# EasyEDA Pro project sonnette.epro, board PCB1
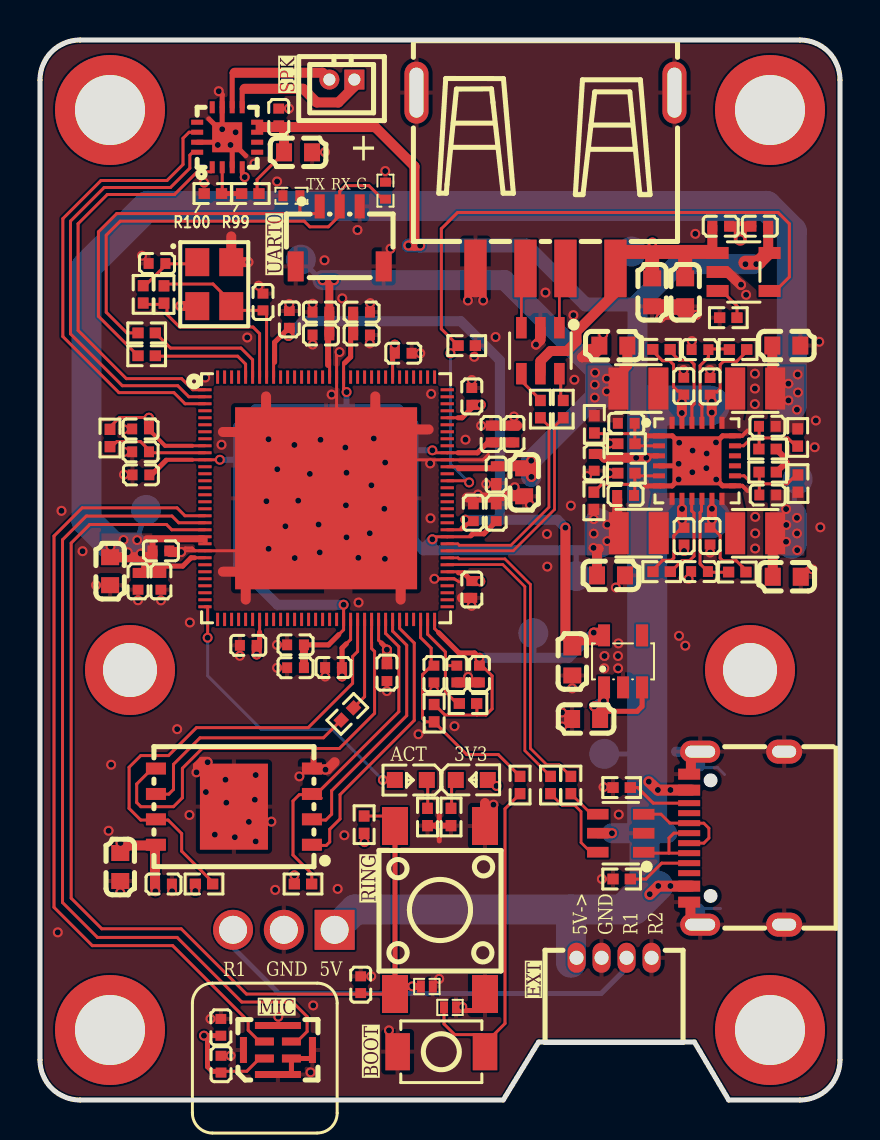
[diagram p1: board, top side]
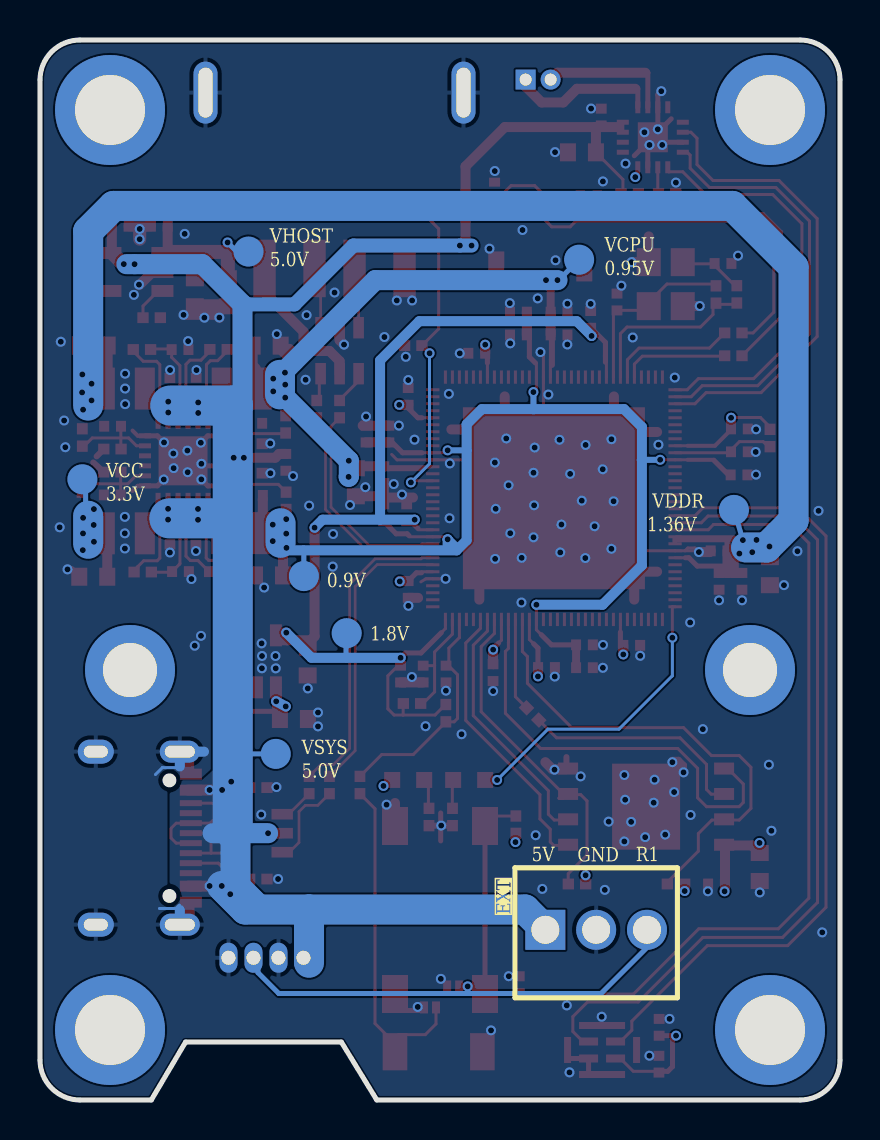
[diagram p2: board, bottom side, seen from below]

Outline 40 x 53 mm; copper layers: Top Layer, Inner1, Inner2, Bottom Layer. Coordinates in mm from the lower left corner of the outline.
Outline path: 0,51 0,2 arc(0.59,0.59) 2,0 23.16,0 24.93,2.9 32.72,2.9 34.44,0 38,0 arc(39.41,0.59) 40,2 40,51 arc(39.41,52.41) 38,53 2,53 arc(0.59,52.41) 0,51
Stack: Top Layer 0.035mm Outer layer thickness 1oz / Dielectric1 0.0994mm 3313 RC57% 4.2mil / Inner1 0.0152mm Inner layer thickness / Dielectric2 1.265mm 1.3mm H/HOZ Copper / Inner2 0.0152mm Inner layer thickness / Dielectric3 0.0994mm 3313 RC57% 4.2mil / Bottom Layer 0.035mm Outer layer thickness 1oz

## Design rules (mm)
template: Custom Config
spacing copperThickness1oz (default): track to track 0.14, other pairs 0.05 to 0.3
spacing copperThickness2oz: track to track 0.203, other pairs 0.152 to 0.3
track width copperThickness1oz (default): min 0.09, default 0.15, max 2.54
track width copperThickness2oz: min 0.203, default 0.254, max 2.54
differential pair differentialPair (default): width min 0.127, default 0.254, max 2.54; gap min 0.152, default 0.152
via viaSize (default): diameter min 0.35, default 0.5, max 10; hole min 0.2, default 0.3, max 6.3
pour e2646 uses copperRegion
pour e2644 uses copperRegion
pour e2643 uses copperRegion

## Placement (name value [footprint] x y rotation side)
C1  100nF  [C0402]  14.05 39.39 0 top
C2  100nF  [C0402]  22.81 31.27 90 top
C3  10uF  [C0402]  14.05 38.25 0 top
C4  22uF  [C0603]  24.21 30.89 90 top
C5  1uF  [C0402]  22.56 33.3 270 top
C6  100nF  [C0402]  16.08 38.25 180 top
C7  10uF  [C0402]  23.7 33.3 270 top
C8  100nF  [C0402]  12.78 22.76 0 top
C9  1uF  [C0402]  16.08 39.39 180 top
C10  1uF  [C0402]  12.78 21.61 0 top
C11  100nF  [C0402]  6.05 27.46 180 top
C12  100nF  [C0402]  6.05 25.93 90 top
C13  10uF  [C0402]  4.9 25.93 90 top
C14  22uF  [C0603]  3.51 26.44 90 top
C15  18pF  [C0402]  5.85 41.83 0 top
C16  18pF  [C0402]  11.15 39.9 90 top
C17  100nF  [C0402]  12.47 39.03 270 top
C18  10nF  [C0402]  5.03 32.41 180 top
C19  100nF  [C0402]  5.03 33.55 0 top
C20  100nF  [C0402]  5.05 31.26 0 top
C21  100nF  [C0402]  17.35 21.37 90 top
C22  1nF  [C0402]  19.7 21.3 270 top
C23  1nF  [C0402]  20.84 21.3 270 top
C24  100nF  [C0402]  21.59 25.53 90 top
C25  100nF  [C0402]  21.67 29.36 270 top
C26  100nF  [C0402]  21.97 21.3 90 top
C27  100nF  [C0402]  22.81 29.36 270 top
C28  100nF  [C0402]  21.59 35.18 270 top
C29  100nF  [C0402]  18.16 37.34 180 top
C30  100nF  [C0402]  14.68 21.62 0 top
C31  100nF  [C0402]  10.41 22.73 0 top
C47  4.7uF  [C0603]  27.31 19.05 0 top
C48  4.7uF  [C0603]  26.62 21.93 90 top
C52  100nF  [C0402]  6.18 10.8 180 top
C53  10uF  [C0603]  4.01 11.65 90 top
C61  1uF  [C0402]  35.99 43.69 0 top
C62  22uF  [C0603]  30.61 40.39 90 top
C63  22uF  [C0603]  32.26 40.39 90 top
C64  100nF  [C0402]  34.04 43.69 180 top
C71  220pF  [C0402]  36.39 30.25 180 top
C72  220pF  [C0402]  29.28 30.23 180 top
C73  220pF  [C0402]  29.31 33.83 180 top
C74  220pF  [C0402]  36.37 33.69 180 top
C81  1uF  [C0402]  27.71 31.88 90 top
C82  10uF  [C0402]  33.51 35.68 270 top
C83  10uF  [C0402]  32.19 35.69 270 top
C84  10uF  [C0402]  33.5 28.2 90 top
C85  10uF  [C0402]  32.2 28.19 90 top
C86  100nF  [C0402]  33 37.52 180 top
C87  100nF  [C0402]  32.98 26.42 180 top
C88  22uF  [C0603]  37.34 26.16 180 top
C89  22uF  [C0603]  28.55 26.23 180 top
C90  22uF  [C0603]  28.67 37.72 0 top
C91  22uF  [C0603]  37.32 37.72 180 top
C92  10uF  [C0603]  12.9 47.38 180 top
C93  100nF  [C0402]  11.94 49.15 270 top
C94  100nF  [C0402]  9.05 1.79 270 top
C95  1uF  [C0402]  9.04 3.63 270 top
C96  10nF  [C0402]  16.04 5.77 270 top
CN1  HC-1.25-2A  [CONN-TH_2P-P1.25_HCTL_HC-1.25-2A]  15.09 51.02 180 top
D7  ESD5451N-MS  [DFN1006-2L_L1.0-W0.6-P0.60-BI]  20.5 4.63 0 top
D8  USBLC6-2SC6  [SOT-23-6_L2.9-W1.6-P0.95-LS2.8-BL]  29.04 13.34 90 top
D10  USBLC6-2SC6  [SOT-23-6_L2.9-W1.6-P0.95-LS2.8-BL]  25.02 37.47 180 top
D11  ESD5451N-MS  [DFN1006-2L_L1.0-W0.6-P0.60-BI]  19.34 5.67 0 top
LED4  KT-0603R  [LED0603-RD]  21.59 16 0 top
LED5  KT-0603R  [LED0603-RD]  18.54 16 180 top
MIC1  MP34DT05TR-A  [MIC-SMD_5P-L3.0-W4.0-P0.85-BL]  11.9 2.5 0 top
NOREF  -  [Pad_e89]  36.5 49.5 0 top
NOREF#2  -  [Pad_e82]  3.5 3.5 0 top
NOREF#3  -  [Pad_e104]  3.5 49.5 0 top
NOREF#4  -  [Pad_e67124]  4.5 21.5 0 top
NOREF#5  -  [Pad_e84]  36.5 3.5 0 top
NOREF#6  -  [Pad_e67123]  35.5 21.5 0 top
R6  22Ω  [R0402]  5.16 40.28 90 top
R7  1MΩ  [R0402]  6.2 40.28 90 top
R16  1kΩ  [R0402]  20.55 14.15 270 top
R17  1kΩ  [R0402]  19.38 14.15 90 top
R33  1kΩ  [R0402]  3.5 33.1 90 top
R34  22Ω  [R0402]  15.37 19.3 45 top
R35  10kΩ  [R0402]  19.71 19.34 90 top
R36  10kΩ  [R0402]  21.4 19.83 0 top
R39  100Ω  [R0402]  24 15.75 270 top
R40  5.1kΩ  [R0402]  29.08 11.05 180 top
R41  5.1kΩ  [R0402]  29.08 15.62 180 top
R42  100Ω  [R0402]  5.33 38.35 180 top
R43  100Ω  [R0402]  5.33 37.21 180 top
R77  10kΩ  [R0402]  13.15 10.8 180 top
R78  10kΩ  [R0402]  8.2 10.8 180 top
R81  2.2Ω  [R0402]  25.53 15.75 90 top
R82  2.2Ω  [R0402]  26.54 15.75 90 top
R83  2.2Ω  [R0402]  26.16 34.54 270 top
R84  2.2Ω  [R0402]  25.02 34.54 270 top
R85  100kΩ  [R0402]  21.34 37.72 180 top
R86  6.8kΩ  [R0402]  34.42 39.12 0 top
R87  510kΩ  [R0402]  37.9 30.82 270 top
R88  110kΩ  [R0402]  36.38 31.4 180 top
R89  150kΩ  [R0402]  37.88 33.13 90 top
R90  120kΩ  [R0402]  36.38 32.55 180 top
R91  120kΩ  [R0402]  29.32 32.81 0 top
R92  100kΩ  [R0402]  29.32 31.34 0 top
R93  69.8kΩ  [R0402]  27.72 33.78 90 top
R94  49.9kΩ  [R0402]  27.69 29.96 270 top
R95  10kΩ  [R0402]  31.08 26.42 180 top
R96  10kΩ  [R0402]  31.07 37.53 180 top
R97  100kΩ  [R0402]  34.9 37.53 0 top
R98  150kΩ  [R0402]  34.86 26.4 180 top
R99  0Ω  [R0402]  10.51 45.32 180 top
R100  0Ω  [R0402]  8.64 45.32 0 top
R101  10kΩ  [R0402]  16.21 13.77 270 top
SW5  TS-1002S-05026C  [KEY-SMD_4P-L6.0-W6.0-P4.50-LS9.0]  20 9.5 90 top
SW6  TS-1088-AR02016  [SW-SMD_L3.9-W3.0-P4.45]  20.07 2.41 180 top
TP2  -  [Test-Point-0.5mm]  29.58 42.42 180 bottom
TP4  -  [Test-Point-0.5mm]  26.81 26.2 180 bottom
TP5  -  [Test-Point-0.5mm]  5.3 29.5 180 bottom
TP6  -  [Test-Point-0.5mm]  13.04 42.02 180 bottom
TP7  -  [Test-Point-0.5mm]  37.88 31.04 180 bottom
TP8  -  [Test-Point-0.5mm]  24.67 23.34 180 bottom
TP9  -  [Test-Point-0.5mm]  28.21 17.31 180 bottom
U1  RK3506G2  [QFN-128_L12.3-W12.3-P0.35-TL-EP9.1]  14.3 30.09 0 top
U4  ESD5341N  [DFN1006-2L-BI]  12.57 45.21 0 top
U5  ESD5341N  [DFN1006-2L-BI]  17.27 45.47 270 top
U14  RT9013-18GB  [SOT-23-5_L3.0-W1.7-P0.95-LS2.8-BR]  29.15 21.93 270 top
U25  SGM2576YN5G/TR  [SOT-23-5_L2.9-W1.6-P0.95-LS2.8-TL]  35.18 41.4 0 top
U28  EA3059QDR  [VQFN-24_L4.0-W4.0-P0.50-TL-EP2.5]  32.85 31.96 0 top
U29  1.5uH  [IND-SMD_L2.5-W2.0_MEKK2520TR47M]  35.76 28.33 180 top
U30  1.5uH  [IND-SMD_L2.5-W2.0_MEKK2520TR47M]  29.94 28.34 0 top
U31  1.5uH  [IND-SMD_L2.5-W2.0_MEKK2520TR47M]  29.92 35.57 0 top
U32  1.5uH  [IND-SMD_L2.5-W2.0_MEKK2520TR47M]  35.76 35.57 180 top
U34  MAX98357AETE+T  [TQFN-16_L3.0-W3.0-P0.50-BL-EP1.5]  9.36 48.14 0 top
U35  ZX-MX1.25-4PWZ  [CONN-TH_4P-P1.25_ZX-MX1.25-4PWZ]  28.7 7.11 0 top
U36  ZX-SH1.0-3PLT  [CONN-SMD_3P-P1.00_HDGC_HDGC1002WV-S-3P]  14.99 43.18 0 top
U37  XT26G04CWSIGA  [WSON-8_L8.0-W6.0-P1.27-TL-EP-1]  9.7 14.67 180 top
U38  DB125-2.54-3P-GN-S  [CONN-TH_DB125-2.54-3P-GN]  12.19 8.51 180 bottom
USB2  TYPE-C 16PIN 2MD(073)  [USB-C-SMD_TYPE-C-6PIN-2MD-073]  34.83 13.09 90 top
USB4  10.0 QHHTZB6.3  [USB-A-TH_10.0QHHTZB6.3]  25.27 45.97 180 top
X3  24MHz  [CRYSTAL-SMD_4P-L3.2-W2.5-BL_SIT8008BI]  8.71 40.79 270 top

## Footprints (pads in the part's own frame, mm; a bottom-side part is the same pattern mirrored in y, then rotated)
C0402
  rect 0.5x0.54 smd: 1(-0.42,0) 2(0.42,0)
C0603
  rect 0.8x0.9 smd: 1(-0.7,0) 2(0.7,0)
CONN-SMD_3P-P1.00_HDGC_HDGC1002WV-S-3P
  rect 0.5x1.2 smd: 1(-1,1.5) 2(0,1.5) 3(1,1.5)
  rect 0.8x1.5 smd: 4(2.2,-1.5) 5(-2.2,-1.5)
CONN-TH_2P-P1.25_HCTL_HC-1.25-2A
  rect 1x1 hole 0.6: 1(-0.625,0)
  round 1 hole 0.6: 2(0.625,0)
CONN-TH_4P-P1.25_ZX-MX1.25-4PWZ
  oval 0.9x1.5 hole 0.7: 1(-1.875,0) 2(-0.625,0) 3(0.625,0) 4(1.875,0)
CONN-TH_DB125-2.54-3P-GN
  rect 2x2 hole 1.4: 1(-2.54,0)
  round 2 hole 1.4: 2(0,0) 3(2.54,0)
CRYSTAL-SMD_4P-L3.2-W2.5-BL_SIT8008BI
  rect 1.4x1.2 smd: 1(-1.1,-0.85) 2(1.1,-0.85) 3(1.1,0.85) 4(-1.1,0.85)
DFN1006-2L-BI
  rect 0.45x0.55 smd: 1(-0.425,0) 2(0.425,0)
DFN1006-2L_L1.0-W0.6-P0.60-BI
  rect 0.4x0.6 smd: 1(-0.3,0) 2(0.3,0)
IND-SMD_L2.5-W2.0_MEKK2520TR47M
  rect 1x2.1 smd: 1(1,0) 2(-1,0)
KEY-SMD_4P-L6.0-W6.0-P4.50-LS9.0
  rect 1.9x1.3 smd: 1(-4.2,2.25) 2(4.2,2.25) 3(-4.2,-2.25) 4(4.2,-2.25)
LED0603-RD
  rect 0.8x0.8 smd: 1(-0.799,0) 2(0.799,0)
MIC-SMD_5P-L3.0-W4.0-P0.85-BL
  rect 0.95x0.4 smd: 1(-0.675,-0.425) 2(0.675,-0.425) 3(0.675,0.425) 4(-0.675,0.425)
  rect 0.35x1.3 smd: 5(-1.725,0) 5(1.725,0)
  rect 2.3x0.35 smd: 5(0,1.225) 5(0,-1.225)
Pad_e82
  round 5.5 hole 3.5: 1(0,0)
Pad_e84
  round 5.5 hole 3.5: 1(0,0)
Pad_e89
  round 5.5 hole 3.5: 1(0,0)
Pad_e104
  round 5.5 hole 3.5: 1(0,0)
Pad_e67123
  round 4.5 hole 2.7: 1(0,0)
Pad_e67124
  round 4.5 hole 2.7: 1(0,0)
QFN-128_L12.3-W12.3-P0.35-TL-EP9.1
  rect 0.665x0.15 smd: 1(-6.058,5.425) 2(-6.058,5.075) 3(-6.058,4.725) 4(-6.058,4.375) 5(-6.058,4.025) 6(-6.058,3.675) 7(-6.058,3.325) 8(-6.058,2.975) 9(-6.058,2.625) 10(-6.058,2.275) 11(-6.058,1.925) 12(-6.058,1.575) 13(-6.058,1.225) 14(-6.058,0.875) 15(-6.058,0.525) 16(-6.058,0.175) 17(-6.058,-0.175) 18(-6.058,-0.525) 19(-6.058,-0.875) 20(-6.058,-1.225) 21(-6.058,-1.575) 22(-6.058,-1.925) 23(-6.058,-2.275) 24(-6.058,-2.625) 25(-6.058,-2.975) 26(-6.058,-3.325) 27(-6.058,-3.675) 28(-6.058,-4.025) 29(-6.058,-4.375) 30(-6.058,-4.725) 31(-6.058,-5.075) 32(-6.058,-5.425) 65(6.058,-5.425) 66(6.058,-5.075) 67(6.058,-4.725) 68(6.058,-4.375) 69(6.058,-4.025) 70(6.058,-3.675) 71(6.058,-3.325) 72(6.058,-2.975) 73(6.058,-2.625) 74(6.058,-2.275) 75(6.058,-1.925) 76(6.058,-1.575) 77(6.058,-1.225) 78(6.058,-0.875) 79(6.058,-0.525) 80(6.058,-0.175) 81(6.058,0.175) 82(6.058,0.525) 83(6.058,0.875) 84(6.058,1.225) 85(6.058,1.575) 86(6.058,1.925) 87(6.058,2.275) 88(6.058,2.625) 89(6.058,2.975) 90(6.058,3.325) 91(6.058,3.675) 92(6.058,4.025) 93(6.058,4.375) 94(6.058,4.725) 95(6.058,5.075) 96(6.058,5.425)
  rect 0.15x0.665 smd: 33(-5.425,-6.058) 34(-5.075,-6.058) 35(-4.725,-6.058) 36(-4.375,-6.058) 37(-4.025,-6.058) 38(-3.675,-6.058) 39(-3.325,-6.058) 40(-2.975,-6.058) 41(-2.625,-6.058) 42(-2.275,-6.058) 43(-1.925,-6.058) 44(-1.575,-6.058) 45(-1.225,-6.058) 46(-0.875,-6.058) 47(-0.525,-6.058) 48(-0.175,-6.058) 49(0.175,-6.058) 50(0.525,-6.058) 51(0.875,-6.058) 52(1.225,-6.058) 53(1.575,-6.058) 54(1.925,-6.058) 55(2.275,-6.058) 56(2.625,-6.058) 57(2.975,-6.058) 58(3.325,-6.058) 59(3.675,-6.058) 60(4.025,-6.058) 61(4.375,-6.058) 62(4.725,-6.058) 63(5.075,-6.058) 64(5.425,-6.058) 97(5.425,6.058) 98(5.075,6.058) 99(4.725,6.058) 100(4.375,6.058) 101(4.025,6.058) 102(3.675,6.058) 103(3.325,6.058) 104(2.975,6.058) 105(2.625,6.058) 106(2.275,6.058) 107(1.925,6.058) 108(1.575,6.058) 109(1.225,6.058) 110(0.875,6.058) 111(0.525,6.058) 112(0.175,6.058) 113(-0.175,6.058) 114(-0.525,6.058) 115(-0.875,6.058) 116(-1.225,6.058) 117(-1.575,6.058) 118(-1.925,6.058) 119(-2.275,6.058) 120(-2.625,6.058) 121(-2.975,6.058) 122(-3.325,6.058) 123(-3.675,6.058) 124(-4.025,6.058) 125(-4.375,6.058) 126(-4.725,6.058) 127(-5.075,6.058) 128(-5.425,6.058)
  rect 9.1x9.1 smd: 129(0,0)
R0402
  rect 0.566x0.54 smd: 1(-0.433,0) 2(0.433,0)
SOT-23-5_L2.9-W1.6-P0.95-LS2.8-TL
  rect 1.1x0.6 smd: 1(-1.3,0.95) 2(-1.3,0) 3(-1.3,-0.95) 4(1.3,-0.95) 5(1.3,0.95)
SOT-23-5_L3.0-W1.7-P0.95-LS2.8-BR
  rect 1.1x0.6 smd: 1(1.3,-0.95) 2(1.3,0) 3(1.3,0.95) 4(-1.3,0.95) 5(-1.3,-0.95)
SOT-23-6_L2.9-W1.6-P0.95-LS2.8-BL
  rect 0.532x1.072 smd: 1(-0.95,-1.149) 2(0,-1.149) 3(0.95,-1.149) 4(0.95,1.149) 5(0,1.149) 6(-0.95,1.149)
SW-SMD_L3.9-W3.0-P4.45
  rect 1.23x1.86 smd: 1(-2.185,0) 2(2.185,0)
Test-Point-0.5mm
  round 1.5 smd: 1(0,0)
TQFN-16_L3.0-W3.0-P0.50-BL-EP1.5
  rect 0.25x0.6 smd: 1(-0.749,-1.5) 2(-0.248,-1.5) 3(0.252,-1.5) 4(0.751,-1.5) 9(0.75,1.5) 10(0.25,1.5) 11(-0.25,1.5) 12(-0.749,1.5)
  rect 0.6x0.25 smd: 5(1.5,-0.748) 6(1.5,-0.248) 7(1.5,0.252) 8(1.5,0.752) 13(-1.5,0.752) 14(-1.5,0.252) 15(-1.5,-0.248) 16(-1.5,-0.748)
  rect 1.5x1.5 smd: 17(0,0)
USB-A-TH_10.0QHHTZB6.3
  rect 1.12x2.88 smd: 1(-3.5,4.395) 2(-1,4.395) 3(1,4.395) 4(3.5,4.395)
  oval 1.2x3.1 hole 0.7x2.5: 5(-6.45,-4.395) 6(6.45,-4.395)
USB-C-SMD_TYPE-C-6PIN-2MD-073
  rect 0.55x1.1 smd: 1(-3.2,2.375) 2(-2.4,2.375) 11(2.4,2.375) 12(3.2,2.375)
  rect 0.3x1.1 smd: 3(-1.75,2.375) 4(-1.25,2.375) 5(-0.75,2.375) 6(-0.25,2.375) 7(0.25,2.375) 8(0.75,2.375) 9(1.25,2.375) 10(1.75,2.375)
  oval 1.1x2 hole 0.6x1.5: 13(-4.325,1.825) 14(4.325,1.825)
  oval 1.2x1.8 hole 0.6x1.2: 13(-4.325,-2.375) 14(4.325,-2.375)
VQFN-24_L4.0-W4.0-P0.50-TL-EP2.5
  rect 0.6x0.25 smd: 1(-1.9,1.25) 2(-1.9,0.75) 3(-1.9,0.25) 4(-1.9,-0.25) 5(-1.9,-0.75) 6(-1.9,-1.25) 13(1.9,-1.25) 14(1.9,-0.75) 15(1.9,-0.25) 16(1.9,0.25) 17(1.9,0.75) 18(1.9,1.25)
  rect 0.25x0.6 smd: 7(-1.25,-1.9) 8(-0.75,-1.9) 9(-0.25,-1.9) 10(0.249,-1.9) 11(0.75,-1.9) 12(1.25,-1.9) 19(1.25,1.9) 20(0.75,1.9) 21(0.249,1.9) 22(-0.25,1.9) 23(-0.75,1.9) 24(-1.25,1.9)
  rect 2.45x2.45 smd: 25(0,0)
WSON-8_L8.0-W6.0-P1.27-TL-EP-1
  rect 1x0.6 smd: 1(-3.9,1.905) 2(-3.9,0.635) 3(-3.9,-0.635) 4(-3.9,-1.905) 5(3.9,-1.905) 6(3.9,-0.635) 7(3.9,0.635) 8(3.9,1.905)
  rect 3.4x4.3 smd: 9(0,0)

## Nets
As in the schematic.

Pads without a net: NOREF 1; NOREF#2 1; NOREF#3 1; NOREF#4 1; NOREF#5 1; NOREF#6 1; U1 26 27 28 29 30 31 60 61 65 66 67 68 77 78 79 80 81 82 84 88 89 90 91 93 94 95 96 97 98 99 100 101 102 104 105 106 107 108 109 113 114 115 116 117 118 119 125; U14 4; U28 15 16; U34 5 6 12 13; USB2 3 9

## Via types
v1: diameter 0.5, hole 0.3, Top Layer to Bottom Layer, 268 vias

## Routing (per net, layer and track width the routed paths; a pad name or vN(x,y) marks a point on that pad's centre or on a via; arc(x,y) is an arc through that point)
GND: length 121.2
  Top Layer w0.15: 7.12,27.46 7.26,27.6 7.61,27.6 7.75,27.46 ; 7.12,27.46 7.75,27.46 ; 7.12,27.46 v1(7.05,27.4) ; 7.75,27.46 U1.24 11.14,27.46 ; U1.69 20.71,26.06 20.96,25.91 ; 22.42,32.28 22.15,32.01 16.23,32.01 ; v1(19.72,26.06) 20.36,26.06 ; 14.83,30.61 U1.111 14.83,37.25 v1(14.98,37.4) ; 12.57,1.28 MIC1.5
  Top Layer w0.2: 34.74,30.71 35.12,30.71 35.38,30.45 ; 34.74,33.21 35.11,33.21 35.38,33.47
  Top Layer w0.25: U34.15 9.11,47.89 U34.17 9.11,48.39 U34.11 9.11,50.25 9.09,50.27 9.09,50.28 v1(8.94,50.44) ; v1(31.93,31.03) 31.61,30.7 31.01,30.7 ; U34.3 9.61,47.67 v1(9.53,47.75) ; 8.69,48.81 8.44,49.06 ; D7.2 20.8,4.48 20.8,4.47 21.65,4.47 22.25,5.07 SW5.3 ; 30.27,30.7 31.01,30.7 ; 31.01,30.7 31.01,30.71 ; 30.97,31.71 31.83,31.71 v1(31.93,31.81) ; 10.28,47.21 10.04,47.46 ; 19.96,12.95 19.96,14.35 ; v1(31.96,32.86) 31.62,33.21 U28.1 30.34,33.21 ; 34.73,33.21 34.13,33.21 v1(33.8,32.88) ; 12.57,1.28 MIC1.2 13.62,2.08 MIC1.5 ; v1(33.81,31.03) 34.13,30.71 34.74,30.71
  Top Layer w0.3: 20.65,13.72 19.51,13.72 ; 8.4,17.01 8.07,17.01 7.8,16.74 7.8,16.37 ; R90.1 36.81,32.54 37.17,32.18 ; v1(38.62,26.53) 38.41,26.53 C88.1 ; 7.8,16.35 7.8,16.37 ; 7.8,16.37 8.22,16.79 8.22,16.88 ; 13.68,16.54 13.68,17.14 ; R88.1 arc(37.07,31.64) 37.34,31.88
  Top Layer w0.5: U1.129 18.03,26.36 18.03,25.02 ; U1.129 16.76,32.55 ; U1.129 10.63,26.42 ; U1.129 11.3,33.09 ; X3.2 7.86,39.7 v1(7.01,39.7) ; v1(32.82,39.26) 31.18,39.26 31.04,39.12 v1(31.03,39.12) ; 14.73,16.89 14.38,16.54 13.68,16.54 ; C26.1 C23.2 ; D10.2 25.02,37.99 v1(24.8,37.77) ; 35.04,40.74 34.32,41.45 ; 22.81,30.19 C2.1 ; 22.81,30.19 22.74,30.12 21.35,30.12 ; 22.81,30.19 C27.1 ; 22.81,30.19 22.81,30.19 C4.1 ; USB2.1 32.52,9.83 32.52,8.69 32.5,8.67 ; 9.14,26.42 10.63,26.42 ; 10.63,26.42 10.29,26.07 10.29,25.02 ; 16.76,32.55 17.75,33.53 19.43,33.53 ; 16.76,32.55 16.76,35.18 ; C5.1 23.86,33.72 ; C61.1 C64.1 ; 9.14,33.4 10.99,33.4 11.3,33.09 ; C11.1 6.53,27.4 v1(7.05,27.4) ; v1(10.42,41.89) X3.4 9.56,43.18 ; 32.29,17.29 32.27,17.31 ; 27.53,37.56 27.1,37.14 27.57,37.14 27.97,37.53 C90.1 ; 11.3,35.18 11.3,33.09 ; SW5.4 22.25,14.85 ; 32.54,16.31 32.54,17.29 ; C24.1 21.1,25.11
  Top Layer w0.65: v1(35.01,43.55) v1(35.01,43.04)
  Top Layer w0.7: C62.1 C63.1
  Inner2 w0.5: v1(35.74,34.79) 35.75,34.8 v1(35.75,35.57) v1(35.75,36.32) ; v1(32.26,22.71) v1(31.95,23.21) ; 28.28,21.58 v1(28.21,21.58) 28.22,21.59 v1(28.22,22.2) v1(28.9,22.2) 28.28,21.58 ; 28.28,21.58 28.9,21.58 v1(28.91,21.59) 28.92,21.6 v1(28.92,22.83) ; v1(35.01,43.55) v1(35.01,43.04) ; v1(21.4,39.98) v1(22.16,39.98) ; v1(24.5,29.75) v1(23.73,30.64) ; v1(35.76,27.57) 35.76,27.58 v1(35.76,28.33) v1(35.76,29.16) ; v1(31.03,39.12) 32.69,39.12 v1(32.82,39.26) ; v1(21.9,30.27) v1(22.31,30.8) ; v1(26.1,18.68) v1(26.1,19.38) ; v1(35.31,40.26) v1(35.05,40.77)
  Bottom Layer w0.15: 34.03,9.58 33.2,9.58 33.03,9.75 ; 33.01,16.67 33.06,16.62 33.88,16.62 34.22,16.28
  Bottom Layer w0.5: 33.01,16.67 USB2.14 31.8,17.42 ; USB2.13 33.01,9.5
  vias: v1(0.89,8.38) v1(1.07,29.46) v1(2.13,27.44) v1(2.8,25.74) v1(3.43,13.46) v1(3.56,16.76) v1(4.01,10.38) v1(4.2,33.53) v1(4.21,32.4) v1(4.2,31.27) v1(4.9,24.99) v1(5.1,42.22) v1(6.05,24.98) v1(6.61,10.44) v1(6.86,18.54) v1(7.49,23.88) v1(7.47,14.25) v1(7.82,16.38) v1(8.2,45.87) v1(8.26,36.12) v1(8.29,15.4) v1(8.38,16.89) v1(8.52,4.06) v1(8.74,13.27) v1(8.89,47.75) v1(9.11,48.54) v1(9.08,32.76) v1(9.27,16.01) v1(9.32,14.86) v1(9.53,2.21) v1(9.74,13.14) v1(9.78,48.39) v1(9.99,22.21) v1(10.36,38.12) v1(10.44,13.91) v1(10.72,46.82) v1(10.74,15.01) v1(10.78,16.25) v1(10.78,12.93) v1(10.93,40.71) v1(11.32,29.94) v1(11.43,33.04) v1(11.43,27.56) v1(11.57,13.92) v1(11.85,22.75) v1(11.76,10.51) v1(11.85,45.93) v1(11.86,31.54) v1(11.86,21.61) v1(11.92,4.16) v1(12.27,28.69) v1(12.45,49.57) v1(12.47,39.81) v1(12.72,32.75) v1(12.74,27.1) v1(12.91,29.97) v1(12.97,16.18) v1(13.49,31.31) v1(13.53,1.38) v1(13.63,39.81) v1(13.63,37.78) v1(13.66,4.73) v1(13.93,28.77) v1(14.03,33.01) v1(13.99,27.38) v1(14.25,47.39) v1(14.22,41.99) v1(14.26,21.17) v1(14.28,16.52) v1(14.58,35.27) v1(14.88,10.56) v1(15.11,40.08) v1(15.22,13.24) v1(15.27,32.62) v1(15.32,31.36) v1(15.3,29.73) v1(15.32,28.13) v1(15.88,43.5) v1(15.92,27.11) v1(15.93,24.88) v1(16.51,39.84) v1(16.49,37.83) v1(16.49,28.34) v1(16.57,30.74) v1(16.56,6.19) v1(16.69,33.08) v1(17.22,29.56) v1(17.24,27.06) v1(17.26,46.45) v1(17.26,31.87) v1(17.34,20.45) v1(17.45,3.48) v1(17.53,42.57) v1(18.92,18.29) v1(19.01,37.33) v1(19.51,31.83) v1(19.52,29.09) v1(19.56,35.31) v1(19.7,20.47) v1(19.94,13.72) v1(19.96,6.06) v1(20.72,18.69) v1(21.11,4.65) v1(21.27,33.02) v1(21.41,21.15) v1(21.59,36) v1(21.58,24.71) v1(21.71,37.16) v1(22.06,33.72) v1(22.67,14.77) v1(22.78,38.15) v1(23.7,34.17) v1(25.27,40.37) v1(25.35,28.3) v1(25.37,26.67) v1(26.54,29.72) v1(26.61,20.58) v1(26.67,39.24) v1(26.72,36.01) v1(27.35,31.2) v1(28.1,11.05) v1(28.16,38.29) v1(28.18,15.65) v1(28.49,32.83) v1(28.48,31.34) v1(28.79,25.62) v1(28.94,14.27) v1(31.78,39.12) v1(32.18,36.5) v1(32.2,27.45) v1(32.43,26.05) v1(32.59,37.94) v1(32.63,32.47) v1(32.62,31.39) v1(32.77,43.31) v1(33.34,32.32) v1(33.32,31.59) v1(33.5,36.5) v1(33.5,27.37) v1(38.74,32.64) v1(38.79,33.97) v1(38.96,37.91) v1(39.02,28.64)
VCC5V0_SYS: length 135.7
  Top Layer w0.15: 12.2,47.25 12.08,47.25 10.85,46.03 10.85,45.41 R99.1 ; 35.11,26.67 34.81,26.96 34.14,26.96 34.01,27.09 34.01,28.23 33.71,28.53 33.67,28.53 ; 35.11,26.67 35.12,26.66 ; 35.11,26.67 35.22,26.56 ; 33.5,35.26 33.64,35.4 33.85,35.4 34.01,35.56 34.01,36.77 34.18,36.94 34.84,36.94 35.22,37.32 35.22,37.53 ; 32.04,35.45 31.88,35.45 31.68,35.65 31.68,36.77 31.48,36.97 31.12,36.97 30.66,37.42 30.66,37.57 ; 32.01,28.54 31.69,28.22 31.69,27.1 31.57,26.98 31.13,26.98 30.67,26.53 30.67,26.41 ; U34.8 U34.7
  Top Layer w0.25: 30.9,32.21 30.43,32.21 30.33,32.12
  Top Layer w0.5: v1(28.6,13.34) D8.5 ; v1(32.09,34.35) 32.09,34.87 ; 12.23,48.65 11.07,48.65 ; 12.23,48.65 16.76,48.65 18.72,46.68 18.72,42.72 ; 12.23,48.65 12.2,48.62 C92.2 ; v1(33.59,34.38) v1(33.59,34.92) ; C81.2 28.05,32.3 28.24,32.11 29.81,32.11 ; U25.5 36.41,42.42 C61.2 ; 18.72,42.72 v1(18.42,42.72) ; 18.72,42.72 v1(19.01,42.72) ; 29.81,32.11 v1(29.81,32.11) ; 29.81,32.11 v1(30.31,32.11) ; v1(33.6,29.02) v1(33.6,29.56) ; v1(32.1,29.01) v1(32.1,29.55)
  Top Layer w0.55: 30.91,10.69 32.58,10.69 ; 30.44,15.91 30.89,15.5 ; 30.9,15.49 32.58,15.49 ; 30.49,10.28 30.91,10.69
  Top Layer w0.7: 35.92,41.92 35.96,41.92 36.42,42.37 ; 35.92,41.87 35.27,41.87
  Inner1 w0.5: v1(35.81,41.8) 35.81,41.79 v1(35.27,41.79) ; 30.9,15.5 v1(31.52,15.5) ; v1(30.89,15.5) v1(30.44,15.92) ; v1(18.42,42.72) v1(19.01,42.72) ; v1(32.09,34.88) v1(32.09,34.35) ; v1(30.49,10.29) v1(30.91,10.7) 31.52,10.7 v1(31.52,10.7) ; v1(33.6,29.56) v1(33.6,29.02) ; v1(29.81,32.11) v1(30.31,32.11) ; v1(32.1,29.55) v1(32.1,29.01) ; v1(33.59,34.92) v1(33.59,34.38)
  Inner2 w0.5: v1(30.31,32.11) 30.31,32.11 v1(29.81,32.11) ; v1(32.1,29.55) v1(32.1,29.01) ; v1(18.42,42.72) v1(19.01,42.72) ; 30.9,15.5 v1(31.52,15.5) ; v1(31.52,10.7) 31.52,10.7 v1(30.91,10.7) v1(30.49,10.29) ; v1(32.09,34.88) v1(32.09,34.35) ; v1(35.81,41.8) 35.81,41.79 v1(35.27,41.79) ; v1(33.59,34.92) v1(33.59,34.38) ; v1(30.44,15.92) v1(30.89,15.5) ; v1(33.6,29.56) v1(33.6,29.02)
  Bottom Layer w0.25: TP9.1 29.81,17.31 29.84,17.27
  Bottom Layer w0.7: v1(18.42,42.72) v1(19.01,42.72) 24.33,42.72 27.28,39.78 29.88,39.78
  Bottom Layer w1: 31.37,13.34 v1(28.6,13.34) ; 35.68,41.79 v1(35.27,41.79) 31.88,41.79 29.88,39.78 29.88,34.72
  Bottom Layer w1.5: 26.55,9.53 29.74,9.53 v1(30.91,10.7) ; 26.55,9.53 15.75,9.53 U38.1 ; 26.55,9.53 26.55,6.86 ; 30.23,10.16 30.23,13.34 ; 29.26,9.67 30.02,10.43
  Bottom Layer w2: 30.36,13.59 30.36,34.72 33.49,34.72 ; 30.61,29.08 33.53,29.08
VCC_1V8: length 55.5
  Top Layer w0.15: U1.120 11.68,37.16 11.73,37.21 ; 21.84,19.25 22.3,19.25 22.61,19.56 22.61,21.21 22.1,21.72 C26.2 ; 21.84,19.25 20.25,19.25 19.72,19.77 19.71,19.77 ; 21.84,19.25 21.84,19.8 ; 21.84,19.8 R36.2 21.84,19.81 21.84,19.8 ; 19.93,23.37 19.73,23.57 19.73,24.03 ; U1.76 21.09,28.51
  Top Layer w0.25: 19.93,23.37 20.95,22.35 21.73,22.35 v1(21.97,22.11)
  Top Layer w0.254: 21.1,28.57 21.48,28.96 21.56,28.96 ; 11.73,36.89 11.73,37.88 12.45,38.61 C17.2
  Top Layer w0.5: 27.64,22.99 27.69,23.03 v1(27.69,23.37) 28.07,23.37 U14.5 28.2,22.99 27.64,22.99 ; 27.64,22.99 26.47,22.99 26.27,23.18 v1(26.27,28.62) ; C17.2 12.47,38.25 v1(12.42,38.2)
  Bottom Layer w0.25: 24.7,22.11 24.7,23.25 24.66,23.28
  Bottom Layer w0.5: v1(21.97,22.11) 26.43,22.11 v1(27.69,23.37) ; 23,29.02 v1(21.27,29.02) ; 23,29.02 25.87,29.02 v1(26.27,28.62) ; 23,29.02 23,36.98 21.04,38.94 13.16,38.94 v1(12.42,38.2)
VCC_3V3: length 41
  Top Layer w0.15: U1.70 20.9,26.41 ; 9.19,1.44 10.34,1.44 10.93,2.03 10.93,2.08 ; 10.08,46.69 10.08,46.27 10.11,46.27 v1(10.24,46.15) ; 15.32,22.81 15.53,23.02 15.53,24.03 ; 16.93,24.03 16.93,22.99 17.01,22.92 ; U1.92 20.9,34.11 ; 5.51,34.11 5.5,34.12 3.97,34.12 3.48,33.63 3.33,33.63 ; U1.103 17.63,36.86 ; 10.98,24.03 10.98,23.39 ; 7.62,32.71 U1.9
  Top Layer w0.2: 7.62,32.71 6.25,32.71 5.47,33.49 5.47,33.57
  Top Layer w0.25: 9.04,1.43 8.61,1.43 8.38,1.67 8.38,3.15 8.44,3.22 ; 8.44,3.22 v1(8.2,3.22) ; 8.44,3.22 9.04,3.22 C95.2 ; 17.34,22.58 17.07,22.85 ; U14.3 30.1,19.68 29.85,19.43 28.39,19.43
  Top Layer w0.254: C24.2 21.18,26.36 20.93,26.36 ; 15.32,22.81 15.1,22.59 15.1,21.62 ; C28.2 21.59,34.6 21.1,34.11 20.9,34.11 ; 10.98,23.39 10.98,22.61 ; 17.63,36.86 17.63,37.23 C29.2
  Top Layer w0.5: 28.14,19.23 28.14,19.68 v1(27.71,19.68) ; C88.2 36.64,28.21 U29.2 ; 17.74,37.76 C29.2 ; 22.04,34.76 C28.2 ; C30.2 15.1,21.62 v1(15.1,21.18) ; 28.14,19.75 28.14,20.01 ; v1(17.34,22.52) 17.35,22.51 C21.2 ; v1(28.19,19.93) 28.19,20.62 U14.1 ; v1(22.01,25.93) 21.99,25.95 C24.2 ; C53.2 4.39,12.73 5.68,12.73 5.75,12.66 5.75,10.65 ; v1(10.84,22.28) 10.84,22.73 ; v1(5.45,34.11) 5.45,33.8
  Inner1 w0.5: v1(27.71,19.68) v1(28.19,19.93)
  Inner1 w1.5: 37.59,27.81 37.59,29.21
  Bottom Layer w0.25: v1(37.31,29.55) 37.72,29.55 37.72,30.88 TP7.1
  Bottom Layer w0.5: v1(27.71,19.68) v1(28.19,19.93)
  Bottom Layer w1.5: 37.59,27.81 37.59,29.21
  vias: v1(4.02,12.85) v1(5.77,10.43) v1(7.77,10.45) v1(12.72,11.23) v1(16.23,12.9) v1(17.74,37.77) v1(22.04,34.76) v1(22.83,15.7) v1(37.31,28.75) v1(37.3,27.91) v1(37.85,29.11) v1(37.85,28.33) v1(37.86,27.49)
VCC_DDR: length 93.4
  Top Layer w0.15: U1.25 7.73,27.11
  Top Layer w0.25: 5.63,26.69 5.63,26.7 ; 5.63,26.69 5.58,26.69 ; 5.63,26.69 7.14,26.69 7.55,27.11 7.73,27.11 ; 8.25,27.91 8.25,28.07
  Top Layer w0.3: C11.2 5.63,28
  Top Layer w0.35: 5.33,28.06 8.17,28.06
  Top Layer w0.5: U32.2 36.62,35.72 C91.2 ; 5.3,26.35 5.31,26.36 5.31,27.14 C14.2 ; 5.3,26.35 C13.2 ; 5.3,26.35 5.61,26.35 ; 5.61,26.35 5.63,26.37 C11.2 ; 5.61,26.35 C12.2
  Inner1 w0.5: v1(4.39,27.39) 4.39,27.79 v1(4.18,28) ; v1(4.18,28) v1(4.86,28) 4.86,27.5 v1(5.03,27.32) 3.88,27.32 v1(3.53,27.67) 4.18,27.67 v1(4.18,28) ; 37.88,35 37.88,34.55 v1(37.85,34.52) ; 37.88,35 37.87,34.98 v1(37.42,34.98) 37.42,35.81 ; 37.88,35 37.88,35.75 ; 37.88,35.75 37.82,35.81 v1(37.42,35.81) ; 37.88,35.75 v1(37.88,36.28)
  Inner2 w0.5: 4.18,27.61 3.88,27.32 ; 4.18,27.61 v1(4.18,28) 4.85,28 v1(4.86,28) 4.86,27.5 v1(5.03,27.32) 3.88,27.32 ; 4.18,27.61 4.63,27.61 4.7,27.69 ; 4.18,27.61 4.12,27.67 v1(3.53,27.67) 3.88,27.32 ; v1(37.88,36.28) 37.88,35.83 ; 37.88,35.83 37.88,35 ; 37.88,35.83 37.87,35.81 v1(37.42,35.81) v1(37.42,34.98) 37.87,34.98 37.88,35 ; v1(37.85,34.52) 37.88,34.55 37.88,35
  Bottom Layer w0.25: TP5.1 v1(4.86,28)
  Bottom Layer w1.5: 4.7,27.63 3.67,27.63 2.32,28.97 2.32,41.64 5.38,44.7 36.32,44.7 37.59,43.43 37.59,34.72
  vias: v1(37.9,35.38)
VCC_OTG: length 18
  Top Layer w0.5: 28.77,41.07 28.77,40.36 26.82,38.42 26.82,37.93 26.34,37.45 25.53,37.45 25.02,36.94 D10.5 ; C64.2 33.62,42.61 ; 33.83,42.4 U25.1
  Top Layer w0.7: 28.77,41.07 28.77,42.4 30.63,42.4 ; 32.29,42.4 32.26,42.37 C63.2 ; 32.29,42.4 30.63,42.4 ; 32.29,42.4 33.57,42.4 ; 30.63,42.4 30.61,42.38 C62.2
  Bottom Layer w0.25: TP2.1 30.16,42.42 v1(30.62,42.88)
VDD_0V9: length 76
  Top Layer w0.15: v1(19.62,32.48) 19.74,32.36 U1.87 20.9,32.36 ; 7.62,32.01 U1.11 v1(8.99,32.01) ; 15.18,36.86 U1.110 15.18,35.55 v1(15.33,35.4) ; v1(19.62,28.03) 19.62,28.07 19.71,28.16 U1.75 21.53,28.16 ; v1(15.18,24.76) 15.18,23.51 14.94,23.27
  Top Layer w0.2: 7.62,32.01 6.3,32.01
  Top Layer w0.254: C5.2 22.39,32.88 21.87,32.36 20.9,32.36 ; 15.53,38.25 15.53,37.15 15.23,36.86 ; 22.81,28.93 22.19,28.31 21.64,28.31 21.55,28.22 ; 14.94,23.27 14.43,22.76 C8.2 ; 5.47,31.26 5.58,31.26 6.3,31.98
  Top Layer w0.4: C8.2 C10.2
  Top Layer w0.5: C89.2 27.85,27.47 27.94,27.56 ; 28.86,30.03 28.86,29.36 28.85,29.35 ; C5.2 C7.2 ; C9.2 C6.2
  Inner1 w0.5: v1(27.69,28.32) 27.69,27.98 ; v1(27.69,28.32) 27.69,28.7 ; v1(27.69,28.32) 27.91,28.32 v1(28.36,28.77) ; 27.69,27.98 27.69,27.62 v1(27.68,27.61) ; 27.69,27.98 27.72,27.94 v1(28.36,27.94) v1(28.36,28.77) ; v1(28.36,28.77) 27.75,28.77 27.69,28.7 ; 27.69,28.7 v1(27.69,29.04)
  Inner2 w0.5: 28.36,28.03 27.94,28.45 ; 28.36,28.03 v1(28.36,27.94) 27.73,27.94 27.69,27.98 ; 28.36,28.03 v1(28.36,28.77) 27.69,28.77 27.69,28.77 ; 27.69,27.98 v1(27.69,28.32) 27.69,28.77 ; 27.69,27.98 27.69,27.62 v1(27.68,27.61) ; 27.69,28.77 v1(27.69,29.04)
  Bottom Layer w0.25: 26.81,25.69 26.81,27.46 26.83,27.48
  Bottom Layer w0.3: v1(15.33,35.4) 15.33,34.47 ; v1(8.99,32.01) 9.91,32.01 ; 18.58,32.48 v1(19.62,32.48) ; 19.62,27.59 19.62,27.49
  Bottom Layer w0.5: 19.62,28.02 19.62,27.59 ; 19.62,28.02 v1(19.62,28.03) ; 19.62,28.02 19.19,27.59 ; 27.94,28.83 27.97,28.83 ; v1(15.18,24.76) 11.87,24.76 9.91,26.73 9.91,33.66 10.79,34.54 17.91,34.54 18.67,33.78 18.67,27.98 19.17,27.48 27.92,27.48 27.95,27.51
  Bottom Layer w1.5: 27.97,28.83 27.97,27.86
VDD_CPU: length 44.8
  Top Layer w0.15: U1.112 14.48,37.03 14.43,37.08 ; 20.36,31.66 20.9,31.66
  Top Layer w0.254: 14.48,38.24 C3.2
  Top Layer w0.3: 14.4,36.75 14.4,38.24 ; 20.95,31.59 22.72,31.59
  Top Layer w0.4: C1.2 14.47,40.99
  Top Layer w0.5: C3.2 C1.2 ; v1(24.57,31.16) 24.56,31.17 v1(24.56,31.96) ; 29.21,36.58 29.37,36.73 C90.2 ; C2.2 23.95,31.69 ; v1(14.13,40.99) v1(14.7,40.99)
  Inner1 w0.5: 28.32,35.43 28.07,35.69 ; 28.32,35.43 27.75,35.43 27.74,35.42 ; 28.32,35.43 v1(28.34,35.43) v1(28.34,36.07) 27.79,36.07 27.75,36.03 ; 27.74,35.42 27.75,36.03 ; 27.74,35.42 v1(27.74,35.12) ; 27.75,36.03 v1(27.75,36.37) ; v1(14.13,40.99) v1(14.7,40.99) ; v1(24.56,31.96) 24.57,31.95 v1(24.57,31.16)
  Inner2 w0.5: 27.75,35.43 27.75,35.13 v1(27.74,35.12) ; 27.75,35.43 28.34,35.43 ; 27.75,35.43 27.75,36.08 ; v1(14.13,40.99) v1(14.7,40.99) ; 27.75,36.08 27.76,36.07 v1(28.34,36.07) v1(28.34,35.43) 28.34,35.43 ; 27.75,36.08 v1(27.75,36.37) ; v1(24.56,31.96) 24.56,31.17 v1(24.57,31.16) ; 28.34,35.43 28.07,35.7 28.07,35.81
  Bottom Layer w0.25: TP6.1 14.07,40.99
  Bottom Layer w0.5: 27.97,36.26 28,36.26
  Bottom Layer w1: v1(24.57,31.16) 24.56,31.17 v1(24.56,31.96) 27.74,35.14 27.96,35.14 ; 27.97,36.26 23.23,40.99 v1(14.7,40.99) v1(14.13,40.99)
  Bottom Layer w1.5: 28,36.26 28,35.28
  vias: v1(27.74,35.77)
ACTLED: length 15.1
  Top Layer w0.15: v1(8.38,23.11) 8.38,24.66 U1.32 ; LED5.2 v1(17.15,16)
  Bottom Layer w0.15: v1(8.38,23.11) 8.38,21.21 11.05,18.54 14.6,18.54 v1(17.15,16)
DBG_CC1: length 3.3
  Top Layer w0.15: R40.1 30.29,11.05 31.09,11.84 USB2.4
DBG_CC2: length 3.3
  Top Layer w0.15: R41.1 29.88,15.62 30.66,14.84 USB2.10
DBG_DN: length 14.3
  Top Layer w0.136: 25.53,16.18 24.24,17.46 24.24,25.67 23.14,26.77 20.37,26.77
DBG_DN_C: length 4.2
  Top Layer w0.145: 31.45,12.34 30.23,12.34 D8.1 ; 31.45,12.34 USB2.5 ; 31.45,12.34 31.45,13.1 31.69,13.34 USB2.7
DBG_DP: length 15.4
  Top Layer w0.136: 26.54,16.18 25.96,16.76 25.33,16.76 24.52,17.58 24.52,25.78 23.25,27.06 20.95,27.06 20.9,27.11 20.48,27.11
DBG_DP_C: length 5.1
  Top Layer w0.145: D8.3 31.05,14.29 31.5,13.84 32.46,13.84 32.46,13.84 33.19,13.84 33.45,13.59 33.45,13.1 33.19,12.84 32.46,12.84
FLASH_CLK: length 4.7
  Top Layer w0.15: 16.23,24.03 16.23,20.17 15.67,19.61
FLASH_CS: length 14.1
  Top Layer w0.15: 13.68,12.73 14.31,12.73 14.49,12.9 14.49,13.54 15,14.05 15,15.27 18.71,18.98 18.71,22.85 17.98,23.58 17.98,24.03
FLASH_D0: length 21.6
  Top Layer w0.15: 16.58,24.03 16.58,23.54 16.58,23.54 16.58,22.89 16.58,22.88 16.58,22.58 16.73,22.43 16.73,19.34 14.97,17.58 8.11,17.58 7.12,16.59 7.12,15.11 6.67,14.67 5.04,14.67 4.83,14.88 4.83,15.8 5.57,16.54 5.68,16.54
FLASH_D1: length 12.6
  Top Layer w0.15: 17.63,24.03 17.63,23.44 18.34,22.74 18.34,19.22 14.58,15.46 14.58,14.29 14.29,14 13.68,14
FLASH_D2: length 17
  Top Layer w0.15: 14.06,15.09 13.85,15.09 13.68,15.27 ; 13.68,15.27 12.96,15.27 12.65,14.95 12.65,12.25 13.59,11.31 13.59,10.81 R77.1 ; 13.68,15.27 13.79,15.27 17.94,19.42 17.94,22.67 17.28,23.33 17.28,24.03
FLASH_D3: length 24.5
  Top Layer w0.15: 8.64,10.89 7.08,12.44 7.08,13.32 6.41,14 5.04,14 4.45,14.58 4.45,16.64 5.04,17.22 6.43,17.22 7.82,18.62 13.41,18.62 15.63,20.84 15.63,22.17 15.88,22.42 15.88,24.03
GPIO_R1: length 77.1
  Top Layer w0.15: SW5.1 10.32,5.3 7.06,8.56 3.09,8.56 1.56,10.09 1.56,27.85 2.49,28.78 6.32,28.78 6.59,28.51 U1.21 ; R101.1 17.25,14.2 SW5.2
  Top Layer w0.25: SW5.1 SW5.2
  Top Layer w0.35: 19.01,5.68 19,5.67 18.24,5.67
  Bottom Layer w0.25: U35.3 29.1,6.89 29.1,6.37 28.06,5.33 18.62,5.33 ; 18.62,5.33 11.95,5.33 9.27,8 9.27,8.51 ; 18.62,5.33 v1(18.62,5.68)
NPOR_L: length 5.3
  Top Layer w0.15: 3.34,32.75 3.68,32.75 3.84,32.92 5.03,32.92 5.45,32.5 C18.1 5.5,32.36 U1.10
OSC_XI: length 9.2
  Top Layer w0.15: U1.121 11.33,39.41 11.25,39.48 9.77,39.48 X3.3 ; 9.62,39.73 9.62,39.83 8.65,40.8 6.24,40.8 6.16,40.72
OSC_XO: length 8.9
  Top Layer w0.15: 6.17,39.85 6.35,39.67 6.35,39.28 6.98,38.65 10.65,38.65 10.98,38.32 U1.122 ; 6.17,39.79 6.16,39.78 5.13,39.78
OTG_DN: length 11
  Top Layer w0.136: U1.73 23.66,27.46 25.72,29.53 25.72,33.67 26.16,34.11
OTG_DN_C: length 2.6
  Top Layer w0.136: 26.27,41.07 25.97,40.77 D10.1
OTG_DP: length 10.6
  Top Layer w0.136: 25.02,34.11 25.45,33.68 25.45,29.64 23.55,27.74 20.96,27.74 20.89,27.81 U1.74
OTG_DP_C: length 2.5
  Top Layer w0.136: 24.27,41.07 24.07,40.87 24.07,38.61
PDM_CLK: length 42.2
  Top Layer w0.15: U1.20 6.94,28.86 6.6,29.2 2.31,29.2 1.13,28.01 1.13,9.87 2.87,8.13 6.86,8.13 10.09,4.9 12.63,4.9 13.36,4.17 13.36,3.42 12.86,2.92 MIC1.3
PDM_SDI: length 40.4
  Top Layer w0.15: MIC1.4 10.97,2.92 10.41,3.49 10.41,3.94 6.63,7.72 2.62,7.72 0.7,9.63 0.7,28.2 2.11,29.61 6.85,29.61 7.25,29.21 U1.19
PMIC_EN1: length 4.8
  Top Layer w0.15: 33.32,26.38 33.33,26.39 34.44,26.39 ; 33.37,26.44 33.03,26.78 33.03,26.78 33,26.82 33,29.37 33.07,29.44 33.07,29.89
PMIC_EN2: length 4.3
  Top Layer w0.15: 32.58,29.96 32.58,29.46 32.7,29.34 32.7,27.19 32.48,26.97 32.1,26.97 31.53,26.41 31.53,26.36
PMIC_EN3: length 4.5
  Top Layer w0.15: R96.1 31.51,37.44 31.95,36.99 32.5,36.99 32.7,36.78 32.7,34.8 32.6,34.7 32.6,33.86
PMIC_EN4: length 4.9
  Top Layer w0.15: 33.1,33.86 33.1,34.68 33,34.77 33,36.72 33.42,37.13 33.42,37.52 ; 33.44,37.53 33.46,37.55 34.46,37.55
PMIC_FB1: length 4.6
  Top Layer w0.15: R88.2 35.97,31.38 35.97,30.81 ; 35.97,30.25 35.97,30.81 ; 35.97,30.81 37.36,30.81 37.81,31.26 R87.1 ; 35.97,30.81 35.61,30.81 35.21,31.21 U28.14
PMIC_FB2: length 4.3
  Top Layer w0.15: 29.74,30.79 29.74,31.25 29.78,31.21 U28.5 ; 29.74,30.79 29.74,30.36 ; 29.74,30.79 29.73,30.78 28.08,30.78 R94.1
PMIC_FB3: length 4.4
  Top Layer w0.15: 27.73,33.36 27.77,33.32 29.71,33.32 29.74,33.36 ; 29.74,33.36 29.74,33.83 ; 29.74,33.36 29.74,32.71 U28.2
PMIC_FB4: length 4.3
  Top Layer w0.15: 34.76,32.71 35.18,32.71 35.57,33.1 35.96,33.1 ; 35.96,33.1 37.39,33.1 37.7,32.79 ; 35.96,33.1 35.96,32.55 ; 35.96,33.1 35.96,33.63
RM_IO15: length 23.7
  Top Layer w0.15: U1.3 7.25,34.81 6.7,35.37 3.95,35.37 1.14,38.17 1.14,44.07 3.05,45.97 6.35,45.97 7.15,46.78 7.15,48.08 7.45,48.39 U34.14
RM_IO16: length 21.8
  Top Layer w0.15: U34.16 7.64,47.39 7.49,47.24 7.49,46.59 6.53,45.62 3.21,45.62 1.52,43.94 1.52,38.31 4.12,35.72 6.89,35.72 7.44,35.16 U1.2
RM_IO17: length 20.9
  Top Layer w0.15: U34.1 8.61,46.46 8.57,46.41 7.86,46.41 6.72,45.28 3.37,45.28 1.91,43.81 1.91,38.48 4.32,36.07 7.08,36.07 7.64,35.51 U1.1
SARADC_IN0_BOOT: length 11.6
  Top Layer w0.15: R35.1 19.7,18.91 ; 19.7,18.91 21.34,17.27 22.91,17.27 24,16.18 ; 19.7,18.91 19.29,18.91 19.13,19.08 19.13,21.27 19.56,21.7 19.56,21.75 ; C22.1 19.67,21.75 19.56,21.75 ; 19.56,21.75 19.56,22.59 19.03,23.12 19.03,24.03
SARADC_IN1_RECOVER/KEY: length 5.5
  Top Layer w0.15: R36.1 20.85,19.83 20.27,20.41 20.27,21.72 ; 20.27,21.72 20.28,21.72 C23.1 ; 20.27,21.72 20.27,22.4 19.38,23.29 U1.63
SPKN: length 6.7
  Top Layer w0.25: 9.7,51.45 9.61,51.36 U34.10
  Top Layer w0.5: 9.73,51.36 14.13,51.36 CN1.2
SPKP: length 7.3
  Top Layer w0.25: 10.11,50.57 U34.9
  Top Layer w0.5: 15.7,50.94 15.7,50.66 14.92,49.88 13.84,49.88 13.16,50.56 10.23,50.56
UART0_RX: length 6.3
  Top Layer w0.15: U1.123 10.63,37.01 10.05,37.6 6.53,37.6 R42.1
UART0_TX: length 5.3
  Top Layer w0.15: U1.124 10.28,36.8 9.88,37.19 5.79,37.19 R43.1
USB20_OTG1_DRV_H: length 36.6
  Top Layer w0.15: U25.4 36.77,40.45 37.47,41.15 37.47,43.81 36.91,44.38 20.88,44.38 20.07,43.56 20.07,38.56 R85.2 v1(20.52,37.34) ; 21.44,30.89 21.38,30.96 20.36,30.96
  Bottom Layer w0.15: v1(21.46,30.88) 20.53,31.81 20.53,37.33 v1(20.52,37.34)
$1N2186: length 3
  Top Layer w0.15: 7.86,42.02 7.65,41.81 6.21,41.81 ; 6.1,41.65 6.14,41.6 5.31,40.77 5.24,40.77
$1N6299: length 22.1
  Top Layer w0.15: U5.2 17.12,45.04 16.44,45.72 15.27,45.72 14.99,45.44 U36.2 14.99,44.23 14.42,43.66 13.49,43.66 13.21,43.94 4.01,43.94 3.31,43.24 3.31,39.39 4.35,38.35 R42.2
$1N6301: length 19.7
  Top Layer w0.15: 12.98,44.32 3.84,44.32 2.92,43.41 2.92,39.19 R43.2 ; 12.98,44.32 13,44.34 U4.2 ; 12.98,44.32 13.99,44.32 U36.1
$1N6766: length 17.1
  Top Layer w0.15: 22.25,2.83 23.25,3.83 23.25,14.56 R39.2 ; 22.25,2.83 SW6.1 ; 22.25,2.83 22.25,3.1 22.08,3.27 20.74,3.27 20.2,3.8 D7.1
$1N16618: length 11.7
  Top Layer w0.15: R34.1 14.17,18.11 8,18.11 6.67,16.78 6.67,15.53 6.44,15.29 5.7,15.29 5.68,15.27
$1N16657: length 4.6
  Top Layer w0.136: D8.6 27.54,12.39 27.05,12.87 27.05,14.42 26.74,14.73 26.11,14.73 R81.1
  Top Layer w0.15: R81.1 25.67,15.31
$1N16696: length 1.8
  Top Layer w0.136: D8.4 27.57,14.29 R82.1
$1N16990: length 1.4
  Top Layer w0.15: D10.6 26.03,36.25 26.03,35.1 R83.1
$1N16994: length 1.7
  Top Layer w0.15: 24.07,36.32 24.07,35.96 25.02,35.01 R84.1
$1N17405: length 1.9
  Top Layer w0.15: U25.3 34.1,40.45 34.85,39.7 R86.2
$1N24281: length 1.5
  Top Layer w0.15: 20.65,14.58 20.58,14.66 20.58,15.79 LED4.1
$1N24284: length 1.3
  Top Layer w0.15: LED5.1 19.39,15.96 19.39,14.79 19.34,14.75
$1N101009: length 2.3
  Top Layer w0.15: R100.2 9.11,45.36 U34.2
  Top Layer w0.25: 10.08,45.32 9.08,45.32 R100.2

## Copper pours and planes (outline as drawn; the poured copper is in the pictures)
GND on Top Layer: -58.66,-46.09 -58.66,109.18 110.43,109.18 110.43,-46.09
GND on Top Layer: 9.43,33.4 10.17,33.4 10.17,31.62 9.43,31.62
GND on Bottom Layer: -57.67,-47.6 -57.67,107.67 111.42,107.67 111.42,-47.6
GND on Inner1: -56.05,-44.25 -56.05,111.03 113.04,111.03 113.04,-44.25
GND on Inner2: 8.61,48.87 10.1,48.87 10.1,47.4 8.61,47.4
GND on Inner2: 31.61,33.42 34.38,33.42 34.38,30.58 31.61,30.58
GND on Inner2: 11.05,33.35 17.53,33.35 17.53,26.74 11.05,26.74
GND on Inner2: 6.92,17.51 12.18,17.51 12.18,12.26 6.92,12.26
VCC5V0_SYS on Bottom Layer: 30.74,10.15 33.52,10.15 33.52,15.98 31.91,15.99 30.74,17.03
VCC_3V3 on Top Layer: 36.49,30.51 38.22,30.51 38.22,27.22 36.49,27.22
VCC_3V3 on Inner2: -57.49,-61.77 -57.49,93.51 111.6,93.51 111.6,-61.77
VCC_DDR on Top Layer: 36.49,36.68 38.21,36.68 38.21,33.38 36.49,33.38
VCC_DDR on Top Layer: 3.08,28.33 5.61,28.33 5.61,26.93 3.08,26.93
VDD_0V9 on Top Layer: 27.36,29.82 29.34,29.82 29.34,27.24 27.36,27.24
VDD_CPU on Top Layer: 27.39,36.72 29.33,36.72 29.33,33.87 27.39,33.87
PMIC_LX1 on Top Layer: 33.97,30.36 35.25,30.36 35.25,27.3 33.97,27.3
PMIC_LX2 on Top Layer: 30.43,30.36 31.72,30.36 31.72,27.3 30.43,27.3
PMIC_LX3 on Top Layer: 30.41,36.63 31.72,36.63 31.72,33.56 30.41,33.56
PMIC_LX4 on Top Layer: 33.98,36.63 35.26,36.63 35.26,33.55 33.98,33.55

Small or netless copper shapes (teardrops, artwork), in the pictures only: 4 on Top Layer

## Text on the board
Bottom Silkscreen Layer: VDDR / 1.36V | VCPU / 0.95V | VHOST / 5.0V | R1 | GND | 5V | 1.8V | 0.9V | VSYS / 5.0V | VCC / 3.3V | EXT
Top Silkscreen Layer: R100 | R99 | TX | RX | G | MIC | RING | BOOT | EXT | 5V-> | GND | R1 | R2 | 5V | ACT | 3V3 | UART0 | SPK | +
